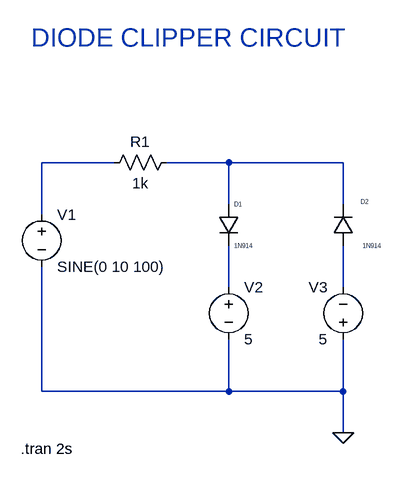
[diagram p0: schematic 7)diode_clippers_circuit.asc]
7)diode_clippers_circuit.asc, the LTspice schematic file:
Version 4
SHEET 1 880 680
WIRE 112 48 0 48
WIRE 288 48 192 48
WIRE 464 48 288 48
WIRE 288 112 288 48
WIRE 464 112 464 48
WIRE 0 128 0 48
WIRE 288 240 288 176
WIRE 464 240 464 176
WIRE 0 400 0 208
WIRE 288 400 288 320
WIRE 288 400 0 400
WIRE 464 400 464 320
WIRE 464 400 288 400
WIRE 464 464 464 400
FLAG 464 464 0
SYMBOL voltage 0 112 R0
WINDOW 123 0 0 Left 0
WINDOW 39 0 0 Left 0
SYMATTR InstName V1
SYMATTR Value SINE(0 10 100)
SYMBOL res 208 32 R90
WINDOW 0 0 56 VBottom 2
WINDOW 3 32 56 VTop 2
SYMATTR InstName R1
SYMATTR Value 1k
SYMBOL diode 272 112 R0
WINDOW 0 24 0 Left 0
WINDOW 3 24 64 Left 0
SYMATTR InstName D1
SYMATTR Value 1N914
SYMBOL diode 480 176 R180
WINDOW 0 -24 68 Left 0
WINDOW 3 -44 0 Left 0
SYMATTR InstName D2
SYMATTR Value 1N914
SYMBOL voltage 288 224 R0
WINDOW 123 0 0 Left 0
WINDOW 39 0 0 Left 0
SYMATTR InstName V2
SYMATTR Value 5
SYMBOL voltage 464 336 R180
WINDOW 0 24 96 Left 2
WINDOW 3 24 16 Left 2
WINDOW 123 0 0 Left 0
WINDOW 39 0 0 Left 0
SYMATTR InstName V3
SYMATTR Value 5
TEXT -32 488 Left 2 !.tran 2s
TEXT -16 -144 Left 4 ;DIODE CLIPPER CIRCUIT

The netlist it stands for:
* 7)diode_clippers_circuit.asc
V1 N001 0 SINE(0 10 100)
R1 N002 N001 1k
D1 N002 N003 1N914
D2 N004 N002 1N914
V2 N003 0 5
V3 0 N004 5
.model D D
.lib standard.dio
.tran 2s
* DIODE CLIPPER CIRCUIT
.backanno
.end